# EAGLE design QTPY.v3 (EAGLE 9.6.2)
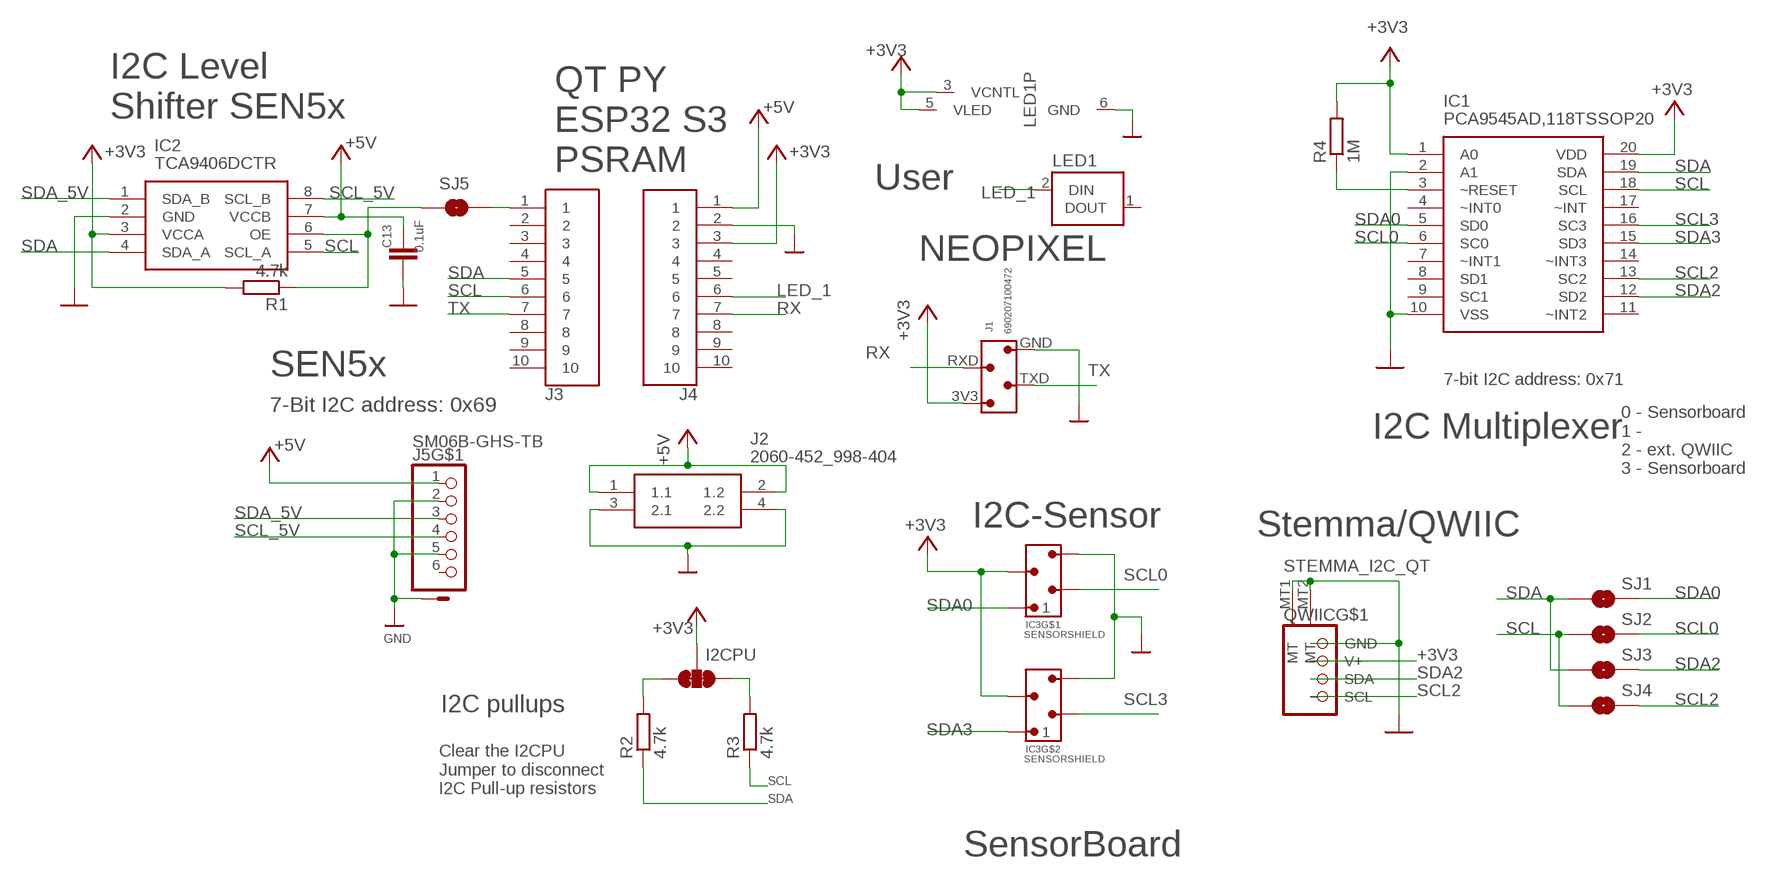
[diagram p0: schematic, sheet 1]

## Parts
C13  0.1uF  C-EUC0603  [C0603]
I2CPU  I2C PU  JUMPER-SMT_3_2-NC_TRACE_SILK  [SMT-JUMPER_3_2-NC_TRACE_SILK]
IC1  PCA9545AD,118TSSOP20  [TSSOP20]
IC2  TCA9406DCTR  [SOP65P400X130-8N]
IC3  SENSORSHIELD  [SENSORSHIELD]
J1  690207100472  LORASHIELD  [LORASHIELD]
J2  2060-452_998-404  [2060452998404]
J3  BG125-10-A-1-1-0440-N-D  [BG12510A110440ND]
J4  BG125-10-A-1-1-0440-N-D  [BG12510A110440ND]
J5  SM06B-GHS-TB  JST-PH-06-SMDSMD  [JST-PH-06-SMD]
LED1  WS2812WS2812  [WS2812]
QWIIC  STEMMA_I2C_QT  [JST_SH4]
R1  4.7k  R-EU_R0603  [R0603]
R2  4.7k  R-EU_R0603  [R0603]
R3  4.7k  R-EU_R0603  [R0603]
R4  1M  R-EU_R0603  [R0603]
SJ1  SOLDERJUMPERNO  [SJ_2S-NO]
SJ2  SOLDERJUMPERNO  [SJ_2S-NO]
SJ3  SOLDERJUMPERNO  [SJ_2S-NO]
SJ4  SOLDERJUMPERNO  [SJ_2S-NO]
SJ5  SOLDERJUMPERNO  [SJ_2S-NO]

## Nets
+3V3: I2CPU.2 IC1.1(A0) IC1.20(VDD) IC2.3(VCCA) IC3.3V3_1 IC3.3V3_2 J1.3V3 J3.3 LED1.3(P:VCNTL) LED1.5(P:VLED) QWIIC.2(V+) R1.2 R4.2
+5V: C13.1 IC2.7(VCCB) J2.1(1.1) J2.2(1.2) J3.1 J5.1
GND [lowpower]: C13.2 IC1.2(A1) IC1.10(VSS) IC2.2(GND) IC3.GND_1 IC3.GND_2 J1.GND J2.3(2.1) J2.4(2.2) J3.2 J5.2 J5.5 J5.7(SHIELD1:S) J5.8(SHIELD1:S) LED1.6(P:GND) QWIIC.1(GND) QWIIC.MT1(MT) QWIIC.MT2(MT)
LED_1: J3.6 LED1.2( :DIN)
N$1: IC2.6(OE) R1.1 SJ5.1
N$2: J4.1 SJ5.2
N$8: IC1.3(~RESET) R4.1
N$9: I2CPU.3 R2.2
N$10: I2CPU.1 R3.2
RX: J1.RXD J3.7
SCL: IC1.18(SCL) IC2.5(SCL_A) J4.6 R3.1 SJ2.1 SJ4.1
SCL0: IC1.6(SC0) IC3.SCL0 SJ2.2
SCL2: IC1.13(SC2) QWIIC.4(SCL) SJ4.2
SCL3: IC1.16(SC3) IC3.SCL1
SCL_5V: IC2.8(SCL_B) J5.4
SDA: IC1.19(SDA) IC2.4(SDA_A) J4.5 R2.1 SJ1.1 SJ3.1
SDA0: IC1.5(SD0) IC3.SDA0 SJ1.2
SDA2: IC1.12(SD2) QWIIC.3(SDA) SJ3.2
SDA3: IC1.15(SD3) IC3.SDA1
SDA_5V: IC2.1(SDA_B) J5.3
TX: J1.TXD J4.7
Unconnected: IC1.4(~INT0) IC1.7(~INT1) IC1.8(SD1) IC1.9(SC1) IC1.11(~INT2) IC1.14(~INT3) IC1.17(~INT) J3.4 J3.5 J3.8 J3.9 J3.10 J4.2 J4.3 J4.4 J4.8 J4.9 J4.10 J5.6 LED1.1( :DOUT)

## Notes on the sheet
- I2C Level
  Shifter SEN5x
- QT PY 
  ESP32 S3 
  PSRAM
- User
- NEOPIXEL
- SEN5x
- 7-bit I2C address: 0x71
- 7-Bit I2C address: 0x69
- I2C Multiplexer
- 0 - Sensorboard
  1 - 
  2 - ext. QWIIC
  3 - Sensorboard
- I2C-Sensor | Stemma/QWIIC
- I2C pullups
- Clear the I2CPU 
  Jumper to disconnect
  I2C Pull-up resistors
- SensorBoard

## Library data of the parts
C13 = rcl:C-EU: CAPACITOR, European symbol; SPICEPREFIX: C
I2CPU = SparkFun-Jumpers:JUMPER-SMT_3_2-NC_TRACE: Normally closed trace jumper (2 of 2 connections) This jumper has a trace between all three pads so they are normally closed (NC). Use a razor knife to open the connection(s). For best results follow the IPC guidelines for cutting traces: Cutout at least 0.063 mm (0.005 in). Remove all loose material to clean up the cut area. Seal the cut with an approved epoxy. Reapply solder to reclose the connection(s).
IC1 = HSW_ATM-IC:PCA9545AD,118: 4-channel I2C-bus switch with interrupt logic and reset Source: Datasheet
IC2 = SamacSys_Parts:TCA9406DCTR: 2-Bit Bidirectional 1-MHz I2C Bus and SMBus Voltage-Level Shifter Source: Datasheet <http://www.ti.com/lit/ds/symlink/tca9406.pdf>; DESCRIPTION: 2-Bit Bidirectional 1-MHz I2C Bus and SMBus Voltage-Level Shifter; HEIGHT: 1.3mm; MANUFACTURER_NAME: Texas Instruments; MANUFACTURER_PART_NUMBER: TCA9406DCTR; MOUSER_PART_NUMBER: 595-TCA9406DCTR; MOUSER_PRICE-STOCK: https://www.mouser.co.uk/ProductDetail/Texas-Instruments/TCA9406DCTR?qs=Ze4%2FuFuz19L6Yntu0RTUyw%3D%3D
IC3 = sensorshield:SENSORSHIELD
J1 = LoRaShieldE5:LORASHIELD: WR-MM Transition Connector KIND PROPERTIES: Pitch 2.54 mm Gender:Transition MATERIAL PROPERTIES: Insulator Material:PBT Insulator Flammability Rating UL94 V-0 Insulator Color:Red Contact Material :Phosphor Bronze Contact Plating :Mat Tin over Nickel Contact Type: Stamped GENERAL PROPERTIES: Operating Temperature:-40 °C up to +105 °C Compliance Lead free / RoHS ELECTRICAL PROPERTIES: IR 1:1 A Working Voltage 100 V (AC) Withstanding Voltage:500 V (AC) Contact Resistance: 10 mΩ Insulation Resistance:1000 MΩ PACKAGING PROPERTIES: cULus Approval:E323964 Packaging :Tube <https://katalog.we-online.com/media/images/v2/o33156v209%20Family_WR-MM_69020710xx72.jpg> Details see: https://katalog.we-online.com/en/em/MM_TRANSITION_CONNECTOR_69020710XX72 Updated by Yingchun,Shan 2019-10-28 2019 (C) Würth Elektronik; CONTACT-RESISTANCE: 10mOhm; DATASHEET-URL: https://www.we-online.com/catalog/datasheet/690207100472.pdf; GENDER: Transition; IR: 1A; L: 8.51mm; PACKAGING: Tube; PART-NUMBER: 690207100472; PINS: 4; PITCH: 2.54; TYPE: Straight; WORKING-VOLTAGE: 100V(AC)
J2 = 2060-452_998-404:2060-452_998-404: SMD PCB terminal block; push-button; 0.75 mm; Pin spacing 4 mm; 2-pole; Push-in CAGE CLAMP; in tape-and-reel packaging Source: Datasheet <https://www.wago.com/2060-452/998-404>; ARROW_PART_NUMBER: 2060-452/998-404; ARROW_PRICE-STOCK: https://www.arrow.com/en/products/2060-452998-404/wago-kontakttechnik-gmbh?region=nac; DESCRIPTION: SMD PCB terminal block; push-button; 0.75 mm; Pin spacing 4 mm; 2-pole; Push-in CAGE CLAMP; in tape-and-reel packaging; HEIGHT: 4.5mm; MANUFACTURER_NAME: Wago; MANUFACTURER_PART_NUMBER: 2060-452/998-404
J3 J4 = SamacSys_Parts:BG125-10-A-1-1-0440-N-D: Board to Board & Mezzanine Connectors 10w, 2.54mm Pitch Socket, SIL, SMT, Vert, D/Ent,R1, GF, Tube Source: Datasheet <https://gct.co/connector/bg125>; DESCRIPTION: Board to Board & Mezzanine Connectors 10w, 2.54mm Pitch Socket, SIL, SMT, Vert, D/Ent,R1, GF, Tube; HEIGHT: 5.15mm; MANUFACTURER_NAME: GCT (GLOBAL CONNECTOR TECHNOLOGY); MANUFACTURER_PART_NUMBER: BG125-10-A-1-1-0440-N-D; MOUSER_PART_NUMBER: 640-BG12510A110440ND; MOUSER_PRICE-STOCK: https://www.mouser.co.uk/ProductDetail/GCT/BG125-10-A-1-1-0440-N-D?qs=pUKx8fyJudC0U%252B3uBQ82rA%3D%3D
J5 = HSW_ATM-Connector_JST:JST-PH-06-SMD
LED1 = WS2812:WS2812
QWIIC = microbuilder:STEMMA_I2C
R1-R4 = rcl:R-EU_: RESISTOR, European symbol; SPICEPREFIX: R
SJ1-SJ5 = HSW_ATM-Passives:SOLDERJUMPER: Solder Jumper Standard SMD solder jumper. Used to automate production. Two varients : Normally Open and Normally Closed are the same, but have different paste layers. NC will have a large amount of paste and should jumper during reflow.

## Net classes
1 highpower: width 0.406 mm, drill 0.483 mm
2 lowpower: width 0.152 mm, drill 0.3 mm

## Board
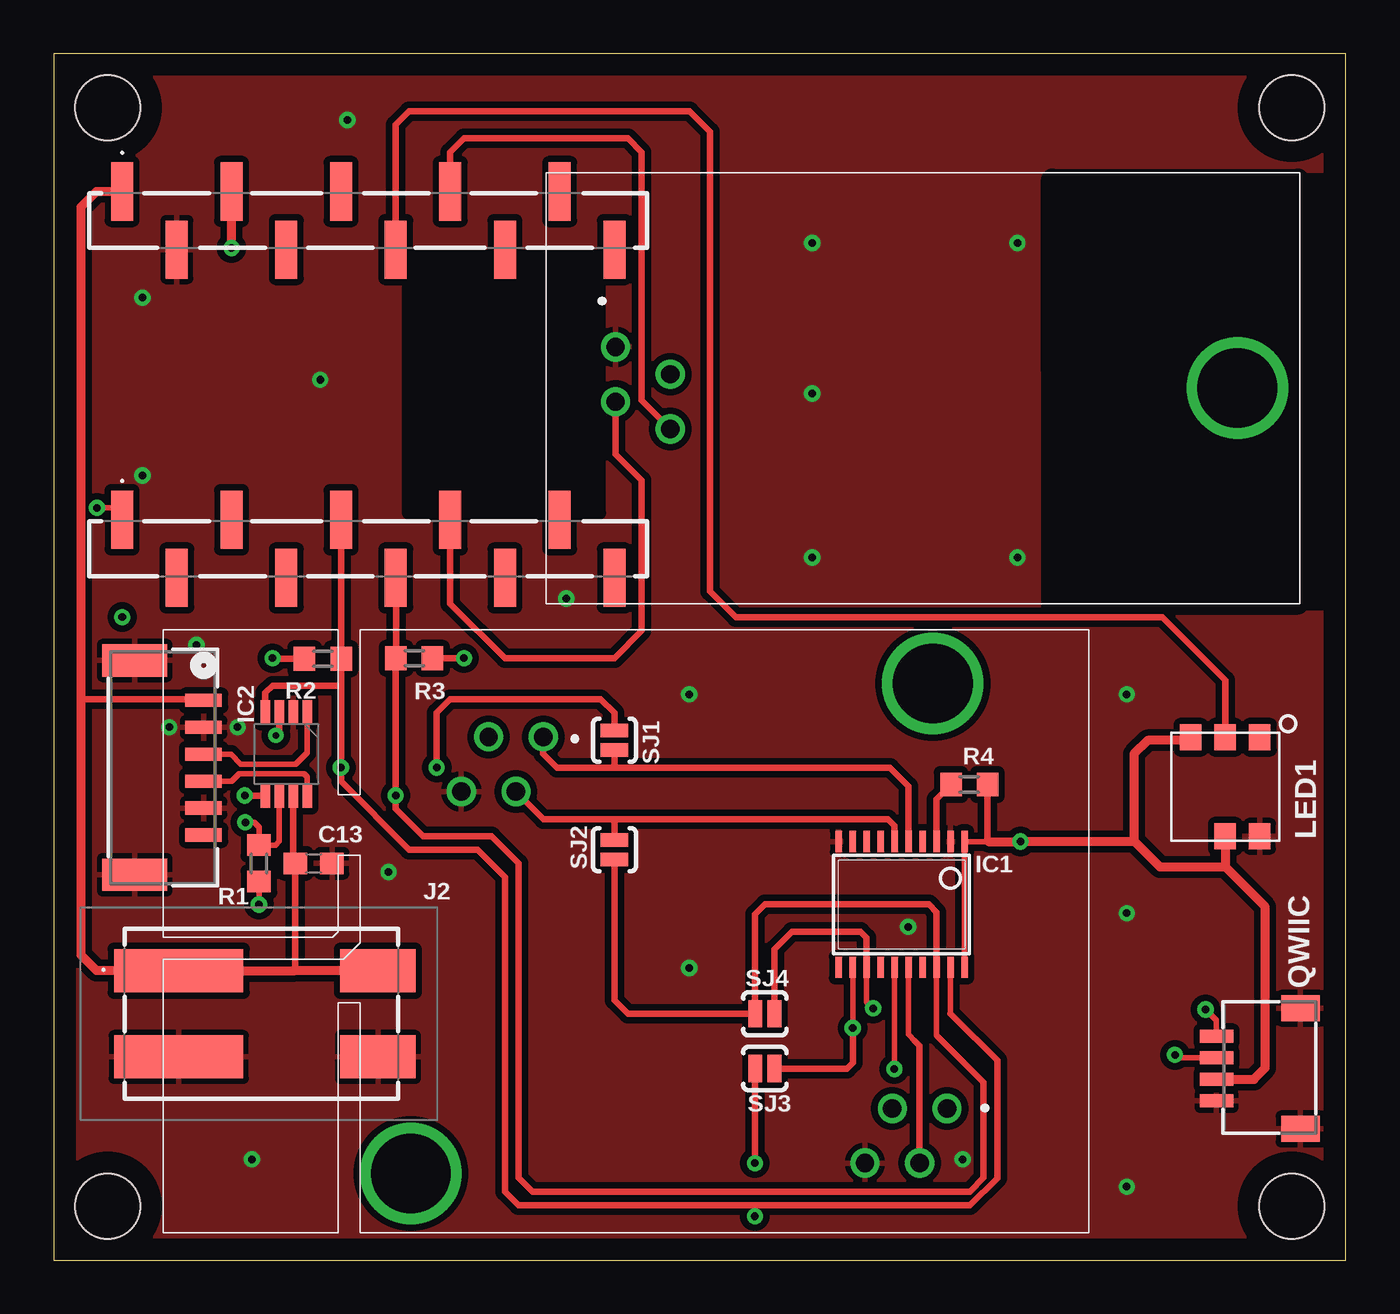
[diagram p1: board, top side]
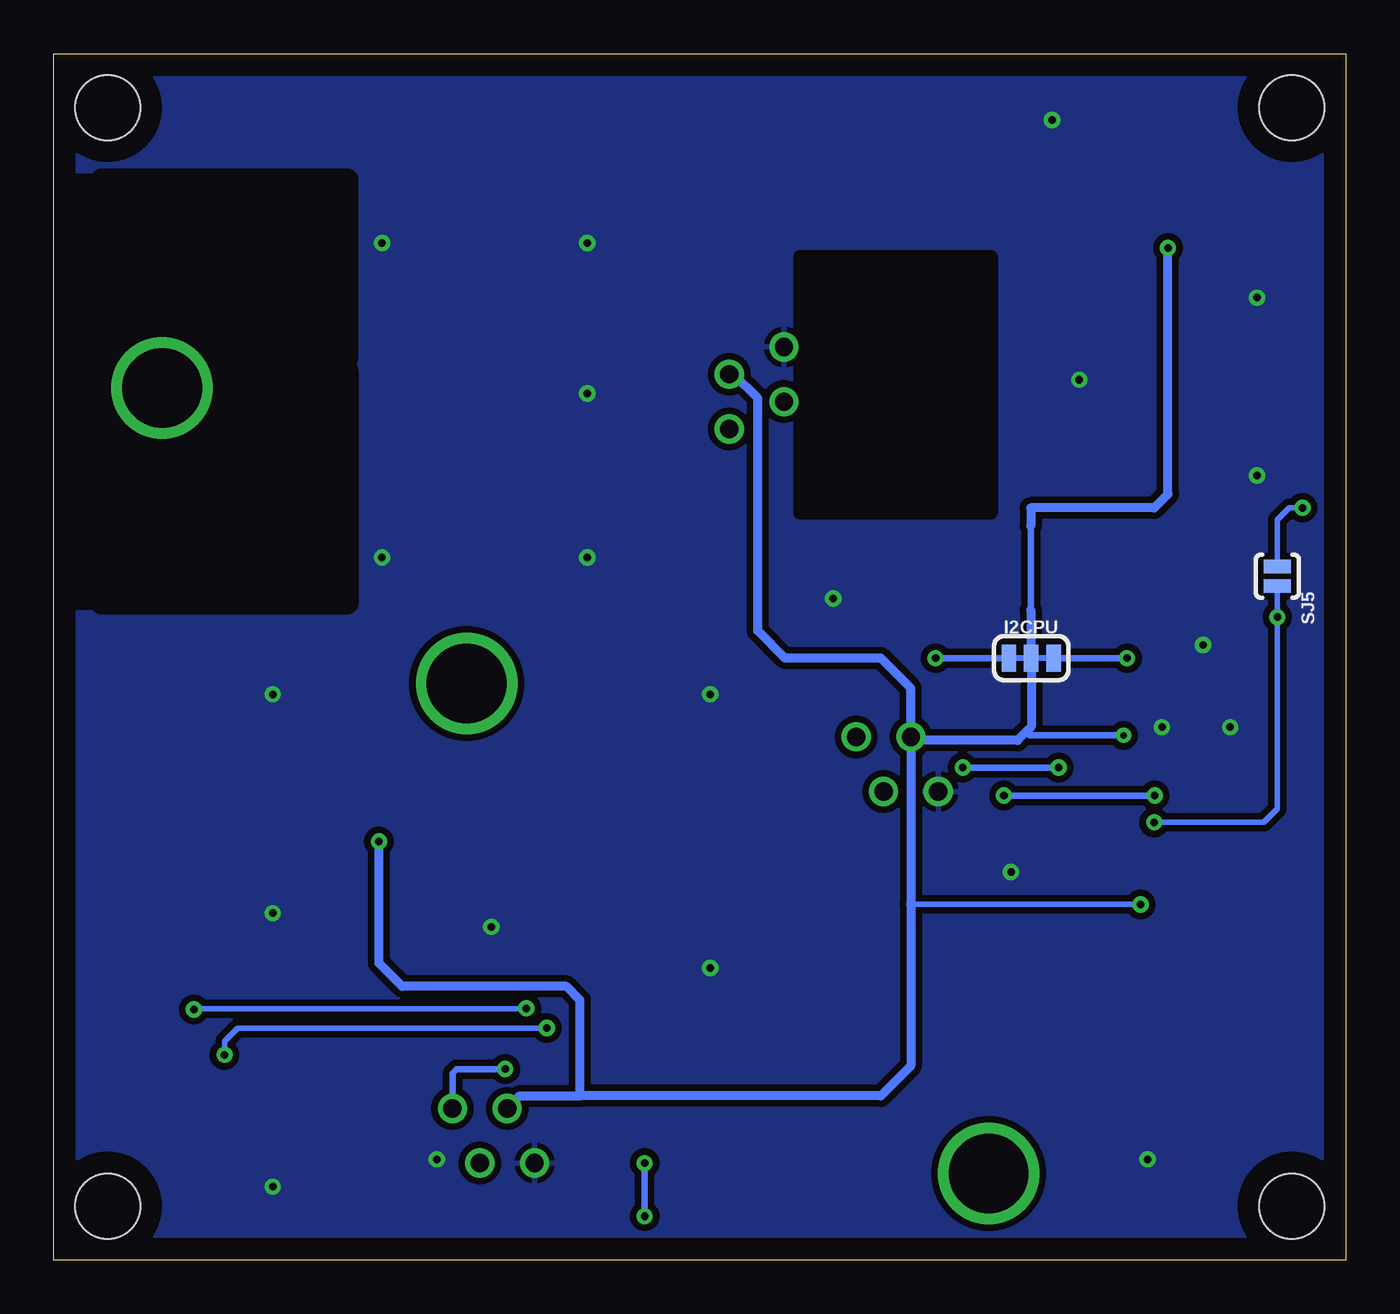
[diagram p2: board, bottom side, seen from below]

Size 60 x 56 mm. Coordinates in mm from the lower left corner, seen from the top.
Outline: 0,0 60,0 60,56 0,56 0,0
Copper layers (1*16): Top 0.035mm / dielectric 1.5mm / Bottom 0.035mm
Design rules "default *": minimum track width 3mil, minimum drill 0.3mm, track to track 6mil, track to pad 6mil, pad to pad 6mil, via to via 6mil, smd to smd 6mil, copper to edge 40mil, drill to drill 6mil, minimum pad ring 10mil, minimum via ring 8mil, stop-mask expansion 4mil, vias tented up to drill 0.3mm, thermal gap 10mil
Holes 3 mm at 2.5,2.5 57.5,2.5 57.5,53.5 2.5,53.5
tRestrict: area 16.5,34.7 to 25.3,46.6; area 46.4,30.5 to 57.8,41.3; area 46.4,38.1 to 57.8,50.2; area 57.8,49.5 to 59.1,50.2; area 57.8,30.5 to 59.1,31.1
bRestrict: area 16.5,34.7 to 25.3,46.6; area 46.4,30.5 to 57.8,41.3; area 46.4,38.1 to 57.8,50.2; area 57.8,30.5 to 59.1,31.1; area 57.8,49.5 to 59.1,50.2

### Footprints (pad centres in the part's own frame; a part is rotated, then mirrored left to right if it is on the bottom)
C0603 = smd 1.1 x 1: 1 -0.85,0; 2 0.85,0
SMT-JUMPER_3_2-NC_TRACE_SILK = smd 0.66 x 1.27: 1 -1.041,0; 2 0,0; 3 1.041,0
TSSOP20 = smd 0.305 x 0.991: 1 -2.925,-2.918; 2 -2.275,-2.918; 3 -1.625,-2.918; 4 -0.975,-2.918; 5 -0.325,-2.918; 6 0.325,-2.918; 7 0.975,-2.918; 8 1.625,-2.918; 9 2.275,-2.918; 10 2.925,-2.918; 11 2.925,2.918; 12 2.275,2.918; 13 1.625,2.918; 14 0.975,2.918; 15 0.325,2.918; 16 -0.325,2.918; 17 -0.975,2.918; 18 -1.625,2.918; 19 -2.275,2.918; 20 -2.925,2.918
SOP65P400X130-8N = smd 1.1 x 0.45: 1 -1.95,0.975; 2 -1.95,0.325; 3 -1.95,-0.325; 4 -1.95,-0.975; 5 1.95,-0.975; 6 1.95,-0.325; 7 1.95,0.325; 8 1.95,0.975
SENSORSHIELD = drill 0.85: 3V3_1 15.113,23.019; 3V3_2 33.864,5.77; GND_1 13.843,20.479; GND_2 32.594,3.23; SCL0 16.383,20.479; SCL1 35.134,3.23; SDA0 17.653,23.019; SDA1 36.404,5.77 | drill 3.7: P$1 11.496,2.75; P$2 35.746,25.5
LORASHIELD = drill 0.85: 3V3 5.773,10.642; GND 3.233,11.912; RXD 5.773,8.102; TXD 3.233,9.372 | drill 3.7: P$1 32.111,10
2060452998404 = smd 6 x 2: 1 -3.725,2; 3 -3.725,-2 | smd 3.5 x 2: 2 5.525,2; 4 5.525,-2
BG12510A110440ND = smd 1.02 x 2.7: 1 11.43,-1.35; 2 8.89,1.35; 3 6.35,-1.35; 4 3.81,1.35; 5 1.27,-1.35; 6 -1.27,1.35; 7 -3.81,-1.35; 8 -6.35,1.35; 9 -8.89,-1.35; 10 -11.43,1.35
JST-PH-06-SMD = smd 0.61 x 1.702: 1 -3.125,1.876; 2 -1.875,1.876; 3 -0.625,1.876; 4 0.625,1.876; 5 1.875,1.876; 6 3.125,1.876 | smd 1.5 x 3: 7 -4.975,-1.324; 8 4.975,-1.324
WS2812 = smd 1.2 x 1: 1 -2.3,1.6; 2 -2.3,0; 3 -2.3,-1.6; 5 2.3,0; 6 2.3,1.6
JST_SH4 = smd 0.6 x 1.55: 1 -1.5,2.514; 2 -0.5,2.514; 3 0.5,2.514; 4 1.5,2.514 | smd 1.2 x 1.8: MT1 -2.8,-1.386; MT2 2.8,-1.386
R0603 = smd 1 x 1.1: 1 -0.85,0; 2 0.85,0
SJ_2S-NO = smd 0.635 x 1.27: 1 -0.45,0; 2 0.45,0

### Placement (x,y rotation side)
C13  12.06,18.41 0 top
I2CPU  14.61,27.94 0 bottom
IC1  39.37,16.51 180 top
IC2  10.79,23.5 270 top
IC3  5.08,1.27 0 top
J1  22.86,30.48 0 top
J2  9.53,11.43 0 top
J3  14.61,48.26 180 top
J4  14.61,33.02 180 top
J5  5.08,22.86 270 top
LED1  54.41,21.97 270 top
QWIIC  56.52,8.89 90 top
R1  9.53,18.41 270 top
R2  12.5,27.91 180 top
R3  16.74,27.94 0 top
R4  42.52,22.07 0 top
SJ1  26.04,24.13 270 top
SJ2  26.04,19.05 90 top
SJ3  33.02,8.89 0 top
SJ4  33.02,11.43 0 top
SJ5  3.17,31.75 90 bottom

### Tracks (layer width: path | path; a pad name or v marks a point on that pad's centre or on a via)
+3V3  (via drill 0.3, 0.35)
  Top 0.152: LED1.3 52.67,24.13
  Top 0.254: 43.41,19.43 IC1.1 IC1.20 | v44.89,19.43 v44.9,19.43 | LED1.5 54.25,19.52 54.25,19.43 | R1.2 v9.53,16.51 | v10.31,24.36 10.43,24.48 10.47,24.48
  Top 0.305: 54.25,19.43 54.41,19.43 | R4.2 43.37,19.47 43.41,19.43 | 10.47,24.48 IC2.3
  Top 0.406: 43.41,19.43 v44.89,19.43 | 54.41,19.43 54.41,18.25 | QWIIC.2 55.74,8.39 56.26,8.91 56.26,16.39 54.41,18.25 | v8.26,46.99 J3.3 | v44.9,19.43 50.19,19.43 | 54.41,18.25 51.37,18.25 50.19,19.43 | 52.67,24.13 50.8,24.13 50.16,23.5 50.16,19.46 50.19,19.43
  Bottom 0.254: v9.53,16.51 20.19,16.51
  Bottom 0.305: 14.63,34.09 14.63,30.18 | v10.31,24.36 14.68,24.36 14.85,24.52
  Bottom 0.406: IC3.3V3_2 38.36,7.62 35.56,7.62 | 35.56,7.62 21.59,7.62 20.19,9.02 20.19,16.51 IC3.3V3_1 | 14.63,34.09 14.63,34.92 8.89,34.92 8.26,35.56 v8.26,46.99 | 14.63,30.18 14.63,27.96 I2CPU.2 14.61,24.77 14.85,24.52 15.24,24.13 20.03,24.13 IC3.3V3_1 | v44.9,19.43 44.9,13.78 43.81,12.7 36.2,12.7 35.56,12.06 35.56,7.62 | IC3.3V3_1 20.19,26.54 21.59,27.94 26.04,27.94 27.3,29.21 27.3,40.01 28.42,41.12 J1.3V3
+5V
  Top 0.305: IC2.7 11.12,18.51 C13.1 11.21,13.43 | J5.1 6.91,26.04 1.27,26.04
  Top 0.406: J2.2 11.43,13.43 11.21,13.43 J2.1 1.99,13.43 1.27,14.15 1.27,26.04 1.27,48.9 1.99,49.61 J3.1
GND  (via drill 0.35)
  other vias: 49.83,26.26 9.19,4.67 15.54,18.01 29.51,13.56 29.51,26.26 35.23,32.61 35.23,47.22 35.23,40.23 4.11,36.42 4.11,44.68 12.37,40.87 13.64,52.93 44.75,47.22 49.83,3.4 49.83,16.1 5.36,24.74 8.53,24.74 6.63,28.55 23.8,30.71 39.67,15.47 42.21,4.67 44.75,32.61
  pour Top (isolate 0.305): 0,0 60.96,0 60.96,56.52 0,56.52
  pour Bottom (isolate 0.305): 0,0 61.59,0 61.59,57.15 0,57.15
LED_1
  Top 0.305: LED1.2 54.41,26.92 51.49,29.84 31.67,29.84 30.48,31.04 30.48,52.38 29.52,53.34 16.51,53.34 15.88,52.7 J3.6
N$1  (via drill 0.35)
  Top 0.254: IC2.6 10.47,19.44 10.3,19.27 R1.1 9.53,20.09 9.3,20.32 v8.89,20.32
  Bottom 0.254: v8.89,20.32 3.81,20.32 3.17,20.95 v3.17,29.84 SJ5.1
N$2  (via drill 0.35)
  Top 0.254: v2,34.92 3.17,34.92 J4.1
  Bottom 0.254: SJ5.2 J4.1 2.62,34.92 v2,34.92
N$8
  Top 0.305: IC1.3 40.99,21.4 R4.1
N$9  (via drill 0.35)
  Top 0.305: R2.2 10.19,27.91 v10.16,27.94
  Bottom 0.305: v10.16,27.94 I2CPU.3
N$10  (via drill 0.35)
  Top 0.305: R3.2 v19.05,27.94
  Bottom 0.305: v19.05,27.94 I2CPU.1
RX
  Top 0.305: J1.RXD 27.3,39.91 27.3,51.44 26.67,52.07 19.05,52.07 18.41,51.44 J3.7
SCL  (via drill 0.35)
  Top 0.254: IC1.18 40.99,10.44 41.27,10.16
  Top 0.305: 41.27,10.16 43.18,8.26 43.18,3.81 42.55,3.17 22.23,3.17 21.59,3.81 21.59,18.41 20.32,19.68 17.14,19.68 15.88,20.95 v15.88,21.57 15.88,27.93 | 15.89,31.66 R3.1 | SJ2.1 26.04,12.06 26.67,11.43 SJ4.1 32.57,16.06 33.02,16.51 40.64,16.51 40.99,16.16 IC1.18 | IC2.5 8.9,21.55 8.89,21.54 v8.87,21.57
  Top 0.406: J4.6 15.89,31.66 | 15.88,27.93 R3.1
  Bottom 0.305: v8.87,21.57 10.16,21.57 v15.88,21.57
SCL0
  Top 0.305: IC1.6 39.05,20.16 38.73,20.47 26.04,20.47 | 26.04,20.47 22.74,20.47 IC3.SCL0 | SJ2.2 26.04,20.47
SCL2  (via drill 0.35)
  Top 0.254: IC1.13 37.74,11.99 v38.05,11.68 | v53.49,11.63 54,11.12 QWIIC.4
  Top 0.305: IC1.13 37.74,14.96 37.47,15.24 34.29,15.24 33.47,14.42 SJ4.2
  Bottom 0.254: v53.49,11.63 53.47,11.66 38.08,11.66 v38.05,11.68
SCL3
  Top 0.254: IC1.16 39.7,10.47 40.01,10.16
  Top 0.305: 40.01,10.16 40.21,9.95 IC3.SCL1
SCL_5V
  Top 0.254: J5.4 8.27,22.23 8.61,22.58 11.63,22.58 11.77,22.44 IC2.8
SDA  (via drill 0.35)
  Top 0.254: 41.65,11.44 IC1.19 | 41.78,11.3 41.86,11.23
  Top 0.305: R2.1 13.34,27.93 | 41.78,11.3 43.81,9.27 43.81,3.8 42.56,2.54 32.59,2.54 | 13.34,26.67 v13.34,22.86 13.34,22.23 16.51,19.05 19.68,19.05 20.95,17.78 20.95,3.17 21.59,2.54 32.59,2.54 | 13.34,26.67 13.34,27.93 | 41.86,11.23 41.65,11.44 | J4.5 13.34,27.93 | SJ1.1 26.04,25.4 25.4,26.04 18.41,26.04 17.78,25.4 v17.78,22.86 | SJ3.1 v32.57,4.5 v32.56,4.5 | v32.56,2.03 32.56,2.52 32.59,2.54 | 13.34,26.67 10.16,26.67 9.82,26.33 IC2.4
  Bottom 0.305: v17.78,22.86 v13.34,22.86 | v32.56,4.5 v32.56,2.03
SDA0
  Top 0.305: IC1.5 39.7,22 38.84,22.86 26.04,22.86 | IC3.SDA0 22.73,23.5 23.37,22.86 26.04,22.86 | SJ1.2 26.04,22.86
SDA2  (via drill 0.35)
  Top 0.254: QWIIC.3 52.2,9.39 v52.07,9.53 | v37.11,10.77 37.11,13.58 IC1.12
  Top 0.305: v37.11,10.77 37.11,9.17 36.83,8.89 SJ3.2
  Bottom 0.254: v52.07,9.53 52.07,10.16 51.46,10.77 v37.11,10.77
SDA3  (via drill 0.35)
  Top 0.254: v39.04,8.87 v39.05,8.87 IC1.15
  Bottom 0.305: IC3.SDA1 41.48,8.68 41.3,8.87 v39.04,8.87
SDA_5V
  Top 0.254: J5.3 8.23,23.48 8.68,23.03 11.24,23.03 11.77,23.56 IC2.1
TX
  Top 0.305: J4.7 18.41,30.48 20.95,27.94 26.04,27.94 27.3,29.21 27.3,36.2 26.09,37.41 J1.TXD

### Text on the board
tDocu: Basisboard Sensor + LoRa + / QT PY / XIAO / o.a. 241229 | QT PY / / XIAO / / o.a. | LoRa E5 | SEN5x | J5 | + | + | - | - | Sensorboard